# Altium project guitar amp.PrjPcb
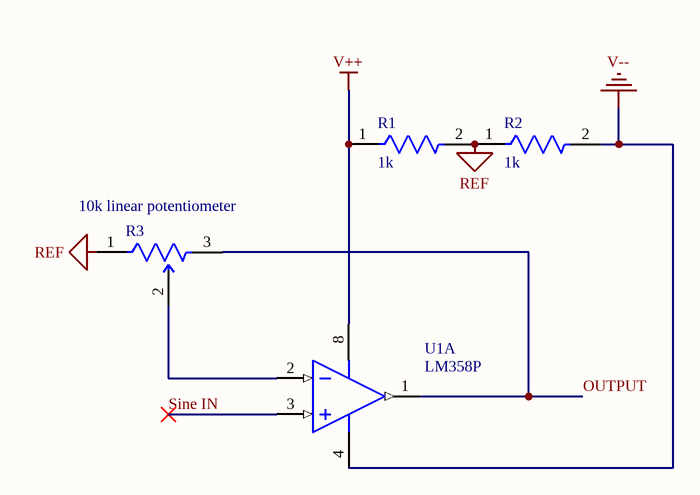
[diagram p0: amp.SchDoc]
1 sheet, 4 parts. Net scope: global (net labels, ports and power ports of the same name join across sheets).
Board file: PCB1.PcbDoc

## Sheet amp.SchDoc
size A4; SheetNumber: 1; SheetTotal: 1

### Parts
R1  1k  [FP-MRS25-MFG]
R2  1k  [FP-MRS25-MFG]
R3  10k linear potentiometer  [FP-TS53YL-MFG]
U1  LM358P  [P0008A]  (part A of 2)

### Nets
REF: R1.2 R2.1 R3.1(a)
V++: R1.1 U1.8(VCC)
V--: R2.2 U1.4(GND)
OUTPUT: R3.3(c) U1.1(1OUT)
Sine IN: U1.3(1IN+)
NetR3_2: R3.2(b) U1.2(1IN-)

### Library data of the parts
R1 R2 = CMP-02408-000051-1: RES 1K OHM 0.6W 1% AXIAL; Power Rating: 600mW; Lead Diameter: 0.6mm; Voltage Rating (DC): 350V; Resistance: 1kR; Temperature Coefficient: 50ppm/°C; Width: 2.5mm; Military Standard: Not; Package Quantity: 5000; Radiation Hardening: No; Case/Package: Axial; Resistance Tolerance: 1%; Resistor Type: Metal Film; Contact Plating: Tin; Length: 6.5mm; Lead Free: Lead Free; RoHS Compliant: Yes; Mount: Through Hole; Number of Pins: 2; Technology: THIN FILM; Voltage Rating: 350V; Min Operating Temperature: -55°C; Weight: 0.00776oz; Diameter: 2.5mm; Construction: Cylindrical; Series: MRS25; Tolerance: 1%; Packaging: Tape and Reel; Max Operating Temperature: 155°C; Max Power Dissipation: 600mW; Number of Terminations: 2; Termination: Axial
R3 = CMP-02410-000004-1: TRIMMER 10K OHM 0.25W GW TOP ADJ; Power Rating: 250mW; Number of Turns: 1; Resistance Tolerance: 20%; Resistance: 10kR; Temperature Coefficient: 100ppm/°C; Mount: Surface Mount; Max Operating Temperature: 125°C; Military Standard: Not; Min Operating Temperature: -55°C; Series: TS53Y; Lead Free: Lead Free; Resistor Type: Cermet; Length: 5mm; Termination: Gull Wing; RoHS Compliant: Yes; Tolerance: 20%; Taper: Linear; Height: 2.7mm; Package Quantity: 1; Width: 5mm; Depth: 6.4mm; Technology: CERMET; Packaging: Tape and Reel; Max Power Dissipation: 250mW; Radiation Hardening: No
U1 = CMP-2000-06549-1: Dual Operational Amplifier, 3 to 32 V, 0 to 70 degC, 8-Pin PDIP (P), RoHS, Tape and Reel; Manufacturer: Technik Industrial; Datasheet Version: Rev. T, 04/2015; Datasheet URL: http://www.ti.com/lit/ds/symlink/lm358.pdf; Manufacturer URL: http://www.technik.com.hk/; Package Description: 8-Pin Double In-line Package, Body 9.59 x 6.35 mm, Pitch 2.54 mm; Mounting Technology: ThroughHole; Package URL: http://www.ti.com/lit/ml/mpdi001b/mpdi001b.pdf; Package Reference: P8